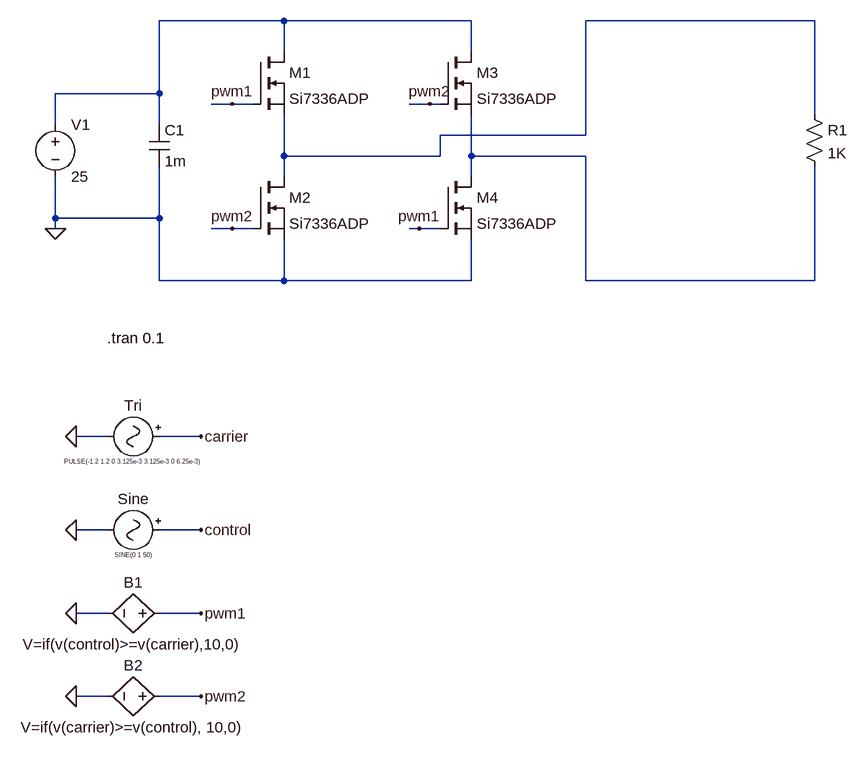
[diagram p0: schematic dcdc_fullbridge.asc]
dcdc_fullbridge.asc, the LTspice schematic file:
Version 4
SHEET 1 1092 1192
WIRE 224 96 32 96
WIRE 512 96 224 96
WIRE 1040 96 688 96
WIRE 224 144 224 96
WIRE 512 144 512 96
WIRE 32 208 32 96
WIRE 32 208 -128 208
WIRE 144 224 112 224
WIRE 176 224 144 224
WIRE 448 224 416 224
WIRE 464 224 448 224
WIRE 1040 240 1040 96
WIRE -128 256 -128 208
WIRE 32 256 32 208
WIRE 688 272 688 96
WIRE 688 272 464 272
WIRE 224 304 224 240
WIRE 464 304 464 272
WIRE 464 304 224 304
WIRE 512 304 512 240
WIRE 688 304 512 304
WIRE 224 336 224 304
WIRE 512 336 512 304
WIRE -128 400 -128 336
WIRE 32 400 32 320
WIRE 32 400 -128 400
WIRE -128 416 -128 400
WIRE 144 416 112 416
WIRE 176 416 144 416
WIRE 432 416 416 416
WIRE 464 416 432 416
WIRE 32 496 32 400
WIRE 224 496 224 432
WIRE 224 496 32 496
WIRE 512 496 512 432
WIRE 512 496 224 496
WIRE 688 496 688 304
WIRE 1040 496 1040 320
WIRE 1040 496 688 496
WIRE -48 736 -96 736
WIRE 96 736 32 736
WIRE -48 880 -96 880
WIRE 96 880 32 880
WIRE -48 1008 -96 1008
WIRE 96 1008 32 1008
WIRE -48 1136 -96 1136
WIRE 96 1136 32 1136
FLAG -128 416 0
FLAG -96 736 0
FLAG -96 880 0
FLAG 96 736 carrier
FLAG 96 880 control
FLAG 144 224 pwm1
FLAG 432 416 pwm1
FLAG 448 224 pwm2
FLAG 144 416 pwm2
FLAG -96 1008 0
FLAG 96 1008 pwm1
FLAG -96 1136 0
FLAG 96 1136 pwm2
SYMBOL voltage -128 240 R0
SYMATTR InstName V1
SYMATTR Value 25
SYMATTR SpiceLine Rser=0.
SYMBOL cap 16 256 R0
SYMATTR InstName C1
SYMATTR Value 1m
SYMATTR SpiceLine Rser=34m Lser=0 mfg="Chemi-Con" pn="LXF25VB102M12X25LL" type="Al electrolytic"
SYMBOL nmos 176 144 R0
SYMATTR InstName M1
SYMATTR Value Si7336ADP
SYMBOL nmos 176 336 R0
SYMATTR InstName M2
SYMATTR Value Si7336ADP
SYMBOL nmos 464 144 R0
SYMATTR InstName M3
SYMATTR Value Si7336ADP
SYMBOL nmos 464 336 R0
SYMATTR InstName M4
SYMATTR Value Si7336ADP
SYMBOL res 1024 224 R0
SYMATTR InstName R1
SYMATTR Value 1K
SYMBOL signal 48 736 R90
WINDOW 0 -32 56 VBottom 2
WINDOW 3 32 56 VTop 0
SYMATTR InstName Tri
SYMATTR Value PULSE(-1.2 1.2 0 3.125e-3 3.125e-3 0 6.25e-3)
SYMBOL signal 48 880 R90
WINDOW 0 -32 56 VBottom 2
WINDOW 3 32 56 VTop 0
SYMATTR InstName Sine
SYMATTR Value SINE(0 1 50)
SYMBOL bv 48 1008 R90
WINDOW 0 -32 56 VBottom 2
WINDOW 3 32 56 VTop 2
SYMATTR InstName B1
SYMATTR Value V=if(v(control)>=v(carrier),10,0)
SYMBOL bv 48 1136 R90
WINDOW 0 -32 56 VBottom 2
WINDOW 3 32 56 VTop 2
SYMATTR InstName B2
SYMATTR Value V=if(v(carrier)>=v(control), 10,0)
TEXT -48 584 Left 2 !.tran 0.1

The netlist it stands for:
* dcdc_fullbridge.asc
V1 N001 0 25 Rser=0.
C1 N001 0 1m Rser=34m Lser=0 mfg="Chemi-Con" pn="LXF25VB102M12X25LL" type="Al electrolytic"
M1 N001 pwm1 N002 N002 Si7336ADP
M2 N002 pwm2 0 0 Si7336ADP
M3 N001 pwm2 N003 N003 Si7336ADP
M4 N003 pwm1 0 0 Si7336ADP
R1 N002 N003 1K
V§Tri carrier 0 PULSE(-1.2 1.2 0 3.125e-3 3.125e-3 0 6.25e-3)
V§Sine control 0 SINE(0 1 50)
B1 pwm1 0 V=if(v(control)>=v(carrier),10,0)
B2 pwm2 0 V=if(v(carrier)>=v(control), 10,0)
.model NMOS NMOS
.model PMOS PMOS
.lib standard.mos
.tran 0.1
.backanno
.end